# EAGLE design 2DD-17-mk-2.0 (EAGLE 7.5.0)
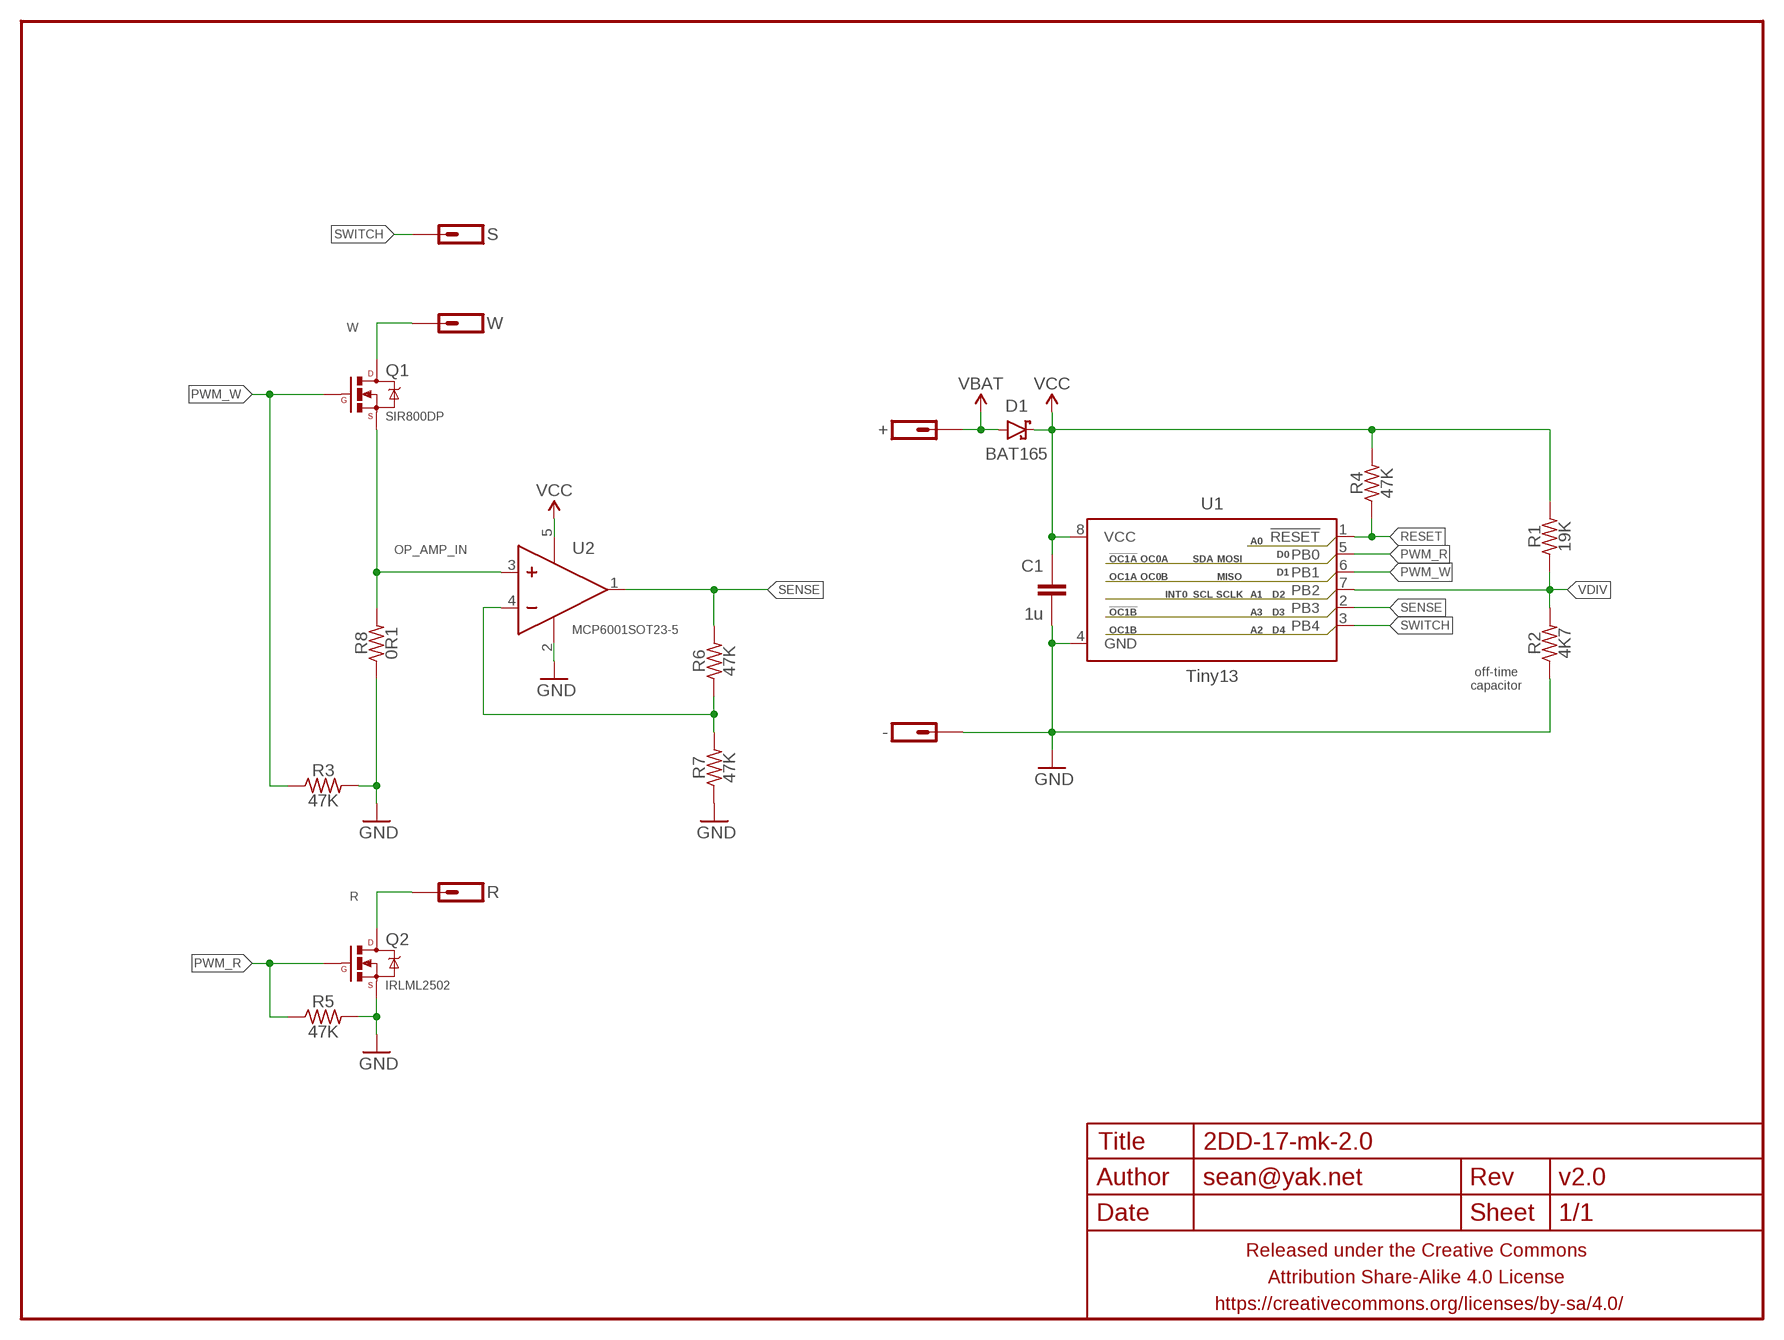
[diagram p0: schematic, sheet 1]

## Parts
+  M01PTH-1MM-CIR-NS  [1X01-1MM-CIR-NS]
-  M01NOT-A-VIA-NOPE  [1X01_NOSILK_NOSTOP]
C1  1u  CAPACITOR-CERAMICC0402  [C0402]
D1  BAT165  DIODE-SCHOTTKYSOD323  [SOD323-SCHOTTKY]
FRAME1  FRAME-LETTERNO_PACKAGE  [DUMMY]
Q1  SIR800DP  MOSFET-NCHANNELSIR800DP  [POWERPACK-SO-8]
Q2  IRLML2502  MOSFET-NCHANNELIRLML2502-SMOL  [SOT23-CLOSER]
R  M01SMD-1.25MM-DIA  [1X01-SMD-1.25MM-DIA-NS]
R1  19K  RESISTORR0402  [R0402]
R2  4K7  RESISTORR0402  [R0402]
R3  47K  RESISTORR0402  [R0402]
R4  47K  RESISTORR0402  [R0402]
R5  47K  RESISTORR0402  [R0402]
R6  47K  RESISTORR0402  [R0402]
R7  47K  RESISTORR0402  [R0402]
R8  0R1  RESISTORR0805  [R0805]
S  M01SMD-1.25MM-DIA  [1X01-SMD-1.25MM-DIA-NS]
U1  Tiny13  ATTINY13SOIC-NARROWPADS  [SO08-NARROWER]
U2  MCP6001SOT23-5  [SOT23-5]
W  M01SMD-1.25MM-DIA  [1X01-SMD-1.25MM-DIA-NS]

## Nets
GND: -.P$1 C1.2 Q2.2(S) R2.1 R3.2 R5.2 R7.1 R8.1 U1.4(GND) U2.2(V-)
N$1: R6.1 R7.2 U2.4(IN-)
OP_AMP_IN: Q1.1(S) Q1.2(S) Q1.3(S) R8.2 U2.3(IN+)
PWM_R: Q2.1(G) R5.1 U1.5(PB0)
PWM_W: Q1.4(G) R3.1 U1.6(PB1)
R: Q2.3(D) R.P$1
RESET: R4.1 U1.1(!RESET)
SENSE: R6.2 U1.2(PB3) U2.1(OUT)
SWITCH: S.P$1 U1.3(PB4)
VBAT: +.1 D1.A
VCC: C1.1 D1.C R1.2 R4.2 U1.8(VCC) U2.5(V+)
VDIV: R1.1 R2.2 U1.7(PB2)
W: Q1.5678(D) W.P$1

## Notes on the sheet
- off-time
  capacitor

## Library data of the parts
+ - R S W = a_parts:M01: Header 1 Standard 1-pin 0.1" header. Use with straight break away headers (SKU : PRT-00116), right angle break away headers (PRT-00553), swiss pins (PRT-00743), machine pins (PRT-00117), and female headers (PRT-00115).
C1 = a_parts:CAPACITOR-CERAMIC: CAPACITOR, European symbol
D1 = a_parts:DIODE-SCHOTTKY: Schottky diodes in SFE's production catalog BAT20J 1A 23V 0.62Vf RB751 120mA 40V 0.37Vf PMEG4005EJ 0.5A 40V 0.42Vf MBRA140 1A 40V 0.5Vf B340A 3A 40V SMA
FRAME1 = a_parts:FRAME-LETTER: Schematic Frame Standard 8.5x11 US Letter frame; DESIGNER: sean@yak.net; VERSION: v2.0
Q1 Q2 = a_parts:MOSFET-NCHANNEL: Common NMOSFET Parts MFG P/N Store ID Prod ID FDD8780 TRANS-09984 SI7820DN TRANS-11055 FDS6630A IC-08089 2N7002PW TRANS-11151 FQP30N06L COM-10213 TRANS-10060 BSS123LT1G TRANS-08345 BSS138 TRANS-00830 BS170 2N7000
R1-R8 = a_parts:RESISTOR: RESISTOR, American symbol
U1 = a_parts:ATTINY13: Atmel 8-pin 1kB flash uC
U2 = a_parts:MCP6001

## Board
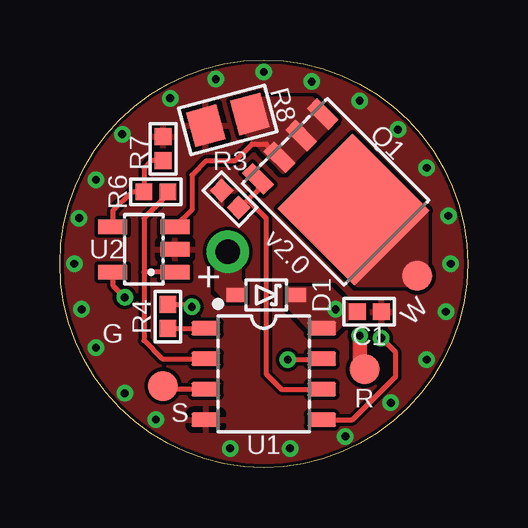
[diagram p1: board, top side]
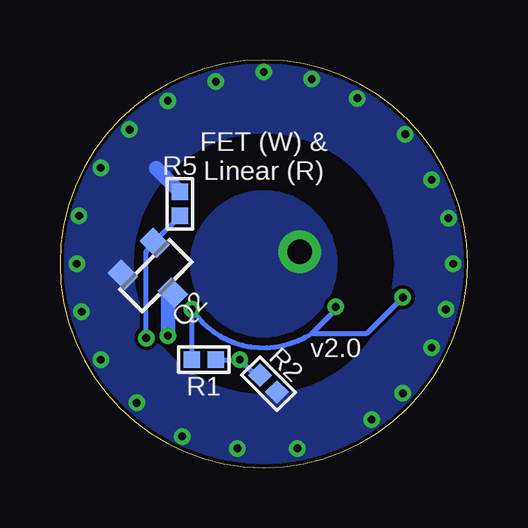
[diagram p2: board, bottom side, seen from below]

Size 17 x 17 mm. Coordinates in mm from the lower left corner, seen from the top.
Outline: 0,8.5 arc-180 17,8.5 arc-180 0,8.5
Copper layers (1*16): Top 0.0356mm / dielectric 1.5011mm / Bottom 0.0356mm
Design rules "LaenPCBOrder2 *": minimum track width 6mil, minimum drill 13mil, track to track 6mil, track to pad 6mil, pad to pad 6mil, via to via 6mil, smd to smd 6mil, copper to edge 6mil, drill to drill 6mil, minimum pad ring 7mil, minimum via ring 7mil, stop-mask expansion 3mil, vias tented up to drill 20mil, thermal gap 10mil

### Footprints (pad centres in the part's own frame; a part is rotated, then mirrored left to right if it is on the bottom)
1X01-1MM-CIR-NS = drill 1.016 pad 1.778: 1 0,0
1X01_NOSILK_NOSTOP = drill 0.33: P$1 0,0
C0402 = smd 0.7 x 0.7: 1 -0.5,0; 2 0.5,0
SOD323-SCHOTTKY = smd 0.8 x 0.6: A -1.25,0; C 1.25,0
POWERPACK-SO-8 = smd 1.27 x 0.61: 1 -2.67,1.905; 2 -2.67,0.635; 3 -2.67,-0.635; 4 -2.67,-1.905 | smd 4.52 x 4.42: 5678 1.045,0
SOT23-CLOSER = smd 0.8 x 1: 1 -0.95,-1; 2 0.95,-1; 3 0,1
1X01-SMD-1.25MM-DIA-NS = smd 1.25 x 1.25: P$1 0,0
R0402 = smd 0.7 x 0.7: 1 -0.5,0; 2 0.5,0
R0805 = smd 1.3 x 1.5: 1 -0.95,0; 2 0.95,0
SO08-NARROWER = smd 0.6 x 1.2: 1 -1.905,-2.416; 2 -0.635,-2.416; 3 0.635,-2.416; 4 1.905,-2.416; 5 1.905,2.416; 6 0.635,2.416; 7 -0.635,2.416; 8 -1.905,2.416
SOT23-5 = smd 0.6 x 1.2: 1 -0.95,-1.3; 2 0,-1.3; 3 0.95,-1.3; 4 0.95,1.3; 5 -0.95,1.3

### Placement (x,y rotation side)
+  7,9 0 top
-  0.6,8.5 90 bottom
C1  12.9,6.5 0 top
D1  8.6,7.2 0 top
FRAME1  0,0 0 top
Q1  11.5,11.5 315 top
Q2  13,8 225 bottom
R  12.7,4.1 90 top
R1  11,4.5 180 bottom
R2  8.3,3.5 135 bottom
R3  7.1,11.2 135 top
R4  4.5,6.3 90 top
R5  12,11 90 bottom
R6  4,11.5 0 top
R7  4.3,13.3 270 top
R8  7,14.5 15 top
S  4.3,3.4 0 top
U1  8.5,3.9 270 top
U2  3.5,9.1 90 top
W  14.9,8 180 top

### Tracks (layer width: path | path; a pad name or v marks a point on that pad's centre or on a via)
GND  (via drill 0.33)
  Bottom 0.6: Q2.2 14.54,8.04 | R5.2 13,12.5
  other vias: 0.9,6.6 1.5,5 0.8,10.4 1.5,12 16.3,8.5 7.1,0.8 9.6,0.8 16.2,10.5 16.1,6.5 8.5,16.5 10.5,16.1 6.5,16.2 15.3,12.5 15.3,4.5 13.8,2.7 4,2 4.6,15.4 12.5,15.3 14.1,14.1 2.6,13.9 11.9,1.3 2.7,3.1
  pour Bottom (isolate 0.152, rank 6, no thermals): 0,8.5 3,8.5 arc90 8.5,3 arc90 14,8.5 17,8.5 arc-90 8.5,0 arc-90
  pour Top (isolate 0.152, rank 6): 17,0 17,17 0,17 0,0
  pour Bottom (isolate 0.152, rank 6, no thermals): 17,8.5 14,8.5 arc90 8.5,14 arc90 3,8.5 0,8.5 arc-90 8.5,17 arc-90
N$1
  Top 0.2: R7.2 3.8,12.8 3.5,12.5 R6.1 3,11.5 2.2,10.7 U2.4
OP_AMP_IN
  Top 0.2: U2.3 5.5,10.75 5.5,12.2 6.1,12.8 7.3,12.8 8,13.5 8.6,13.5 Q1.3
  pour Top (isolate 0.152, rank 2, no thermals): 7.9,15.4 7.5,15 7.5,14.2 9.3,12.3 11.5,14.5 10.5,15.4
PWM_R  (via drill 0.33)
  Top 0.2: U1.5 12.2,2 14,3.8 14,4.8 v13.4,5.4
  Bottom 0.2: v13.4,5.4 13.4,9.01 Q2.1 13.04,9.46 R5.1
PWM_W
  Top 0.2: U1.6 9.23,3.27 8.6,3.9 8.6,10.4 7.85,11.15 | R3.1 7.55,10.85 7.85,11.15 | Q1.4 8.27,11.56 7.85,11.15
R  (via drill 0.33)
  Top 0.6: v12.5,5.5 12.5,4.3 R.P$1
  Bottom 0.6: Q2.3 12.5,7.09 v12.5,5.5
RESET
  Top 0.2: R4.1 U1.1
SENSE
  Top 0.2: R6.2 4.5,11.4 3.5,10.4 3.5,8.15 | U2.1 3.5,8.15 | 3.5,8.15 3.5,5.3 4.26,4.54 U1.2
SWITCH
  Top 0.2: U1.3 4.43,3.27 S.P$1
VBAT
  pour Bottom (isolate 0.152, no thermals): 5.5,8.5 arc-180 11.5,8.5 arc-180
  pour Top (isolate 0.152, rank 2, no thermals): 6.5,9.5 6.5,7.4 6.9,7 7.7,7 7.7,7.6 7.5,7.8 7.5,9.5
VCC  (via drill 0.33)
  Top 0.2: R4.2 5.4,6.8 v5.5,6.7 | U2.5 2.2,7.6 v2.7,7.1
  Bottom 0.2: 6.5,5.6 arc90 v11.5,6.6 R1.2 | 6.5,5.6 4.2,5.6 v2.7,7.1 | v5.5,6.7 5.5,6.6 6.5,5.6
  pour Top (isolate 0.152, rank 2, no thermals): 9.5,7.5 11.3,7.5 12.3,6.5 11.4,5.6 10.6,5.6 9.5,6.7
VDIV  (via drill 0.33)
  Top 0.2: U1.7 10.88,4.5 v9.5,4.5
  Bottom 0.2: R1.1 v9.5,4.5 8.85,3.85 R2.2
W
  pour Top (isolate 0.152, rank 2, no thermals): 12.4,7.6 14.5,7.6 15.3,8.3 15.3,10.7 12.3,13.7 9.3,10.8

### Text on the board
bPlace: FET (W) & / Linear (R)
tNames: G